# Altium schematic sheet MicroMultimeter_OLED_Sch.SchDoc: MicroMultimeter - OLED
size 127 x 101 mm; Author: Hom; CompanyName: KitSprout; DrawnBy: Hom; Engineer: Hom; Organization: KitSprout; Revision: A; SheetNumber: 1; SheetTotal: 1; License: CC BY-SA 4.0; Version: 1.0; LibVersion: 1.4; PageSetup: Record=PageOptions|CenterHorizontal=True|CenterVertical=True|PrintScale=1.00|XCorrection=1.00|YCorrection=1.00|PrintKind=0|BorderSize=5000000|LeftOffset=0|BottomOffset=0|Orientation=2|PaperLength=1000|PaperWidth=1000|Scale=100|PaperSource=7|PrintQuality=-3|MediaType=1|DitherType=10|PrintScaleMode=0|PaperKind=A4|PaperIndex=9
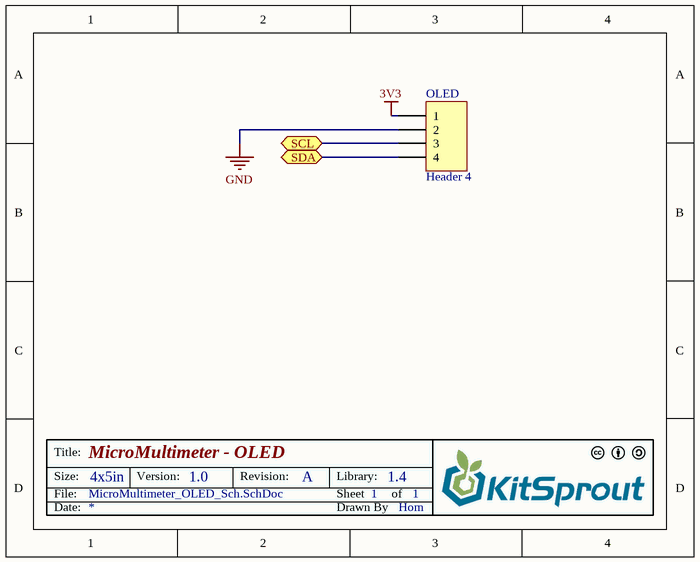
[diagram p0: MicroMultimeter_OLED_Sch.SchDoc]

## Parts
OLED  Header 4  [HDR1X4]

## Ports
SCL, SDA

## Nets
3V3: OLED.1
GND: OLED.2
SCL: OLED.3 ; port SCL
SDA: OLED.4 ; port SDA

## Notes on the sheet
- Title:
- Size:
- Date:
- File:
- 4x5in
- Version:
- Revision:
- Sheet
- Drawn By
- Library:
- of

## Library data of the parts
OLED = Header 4: Header, 4-Pin; LatestRevisionDate: 17-Jul-2002; LatestRevisionNote: Re-released for DXP Platform.; Publisher: Altium Limited